# Altium schematic sheet Sheet1.SchDoc
size A3
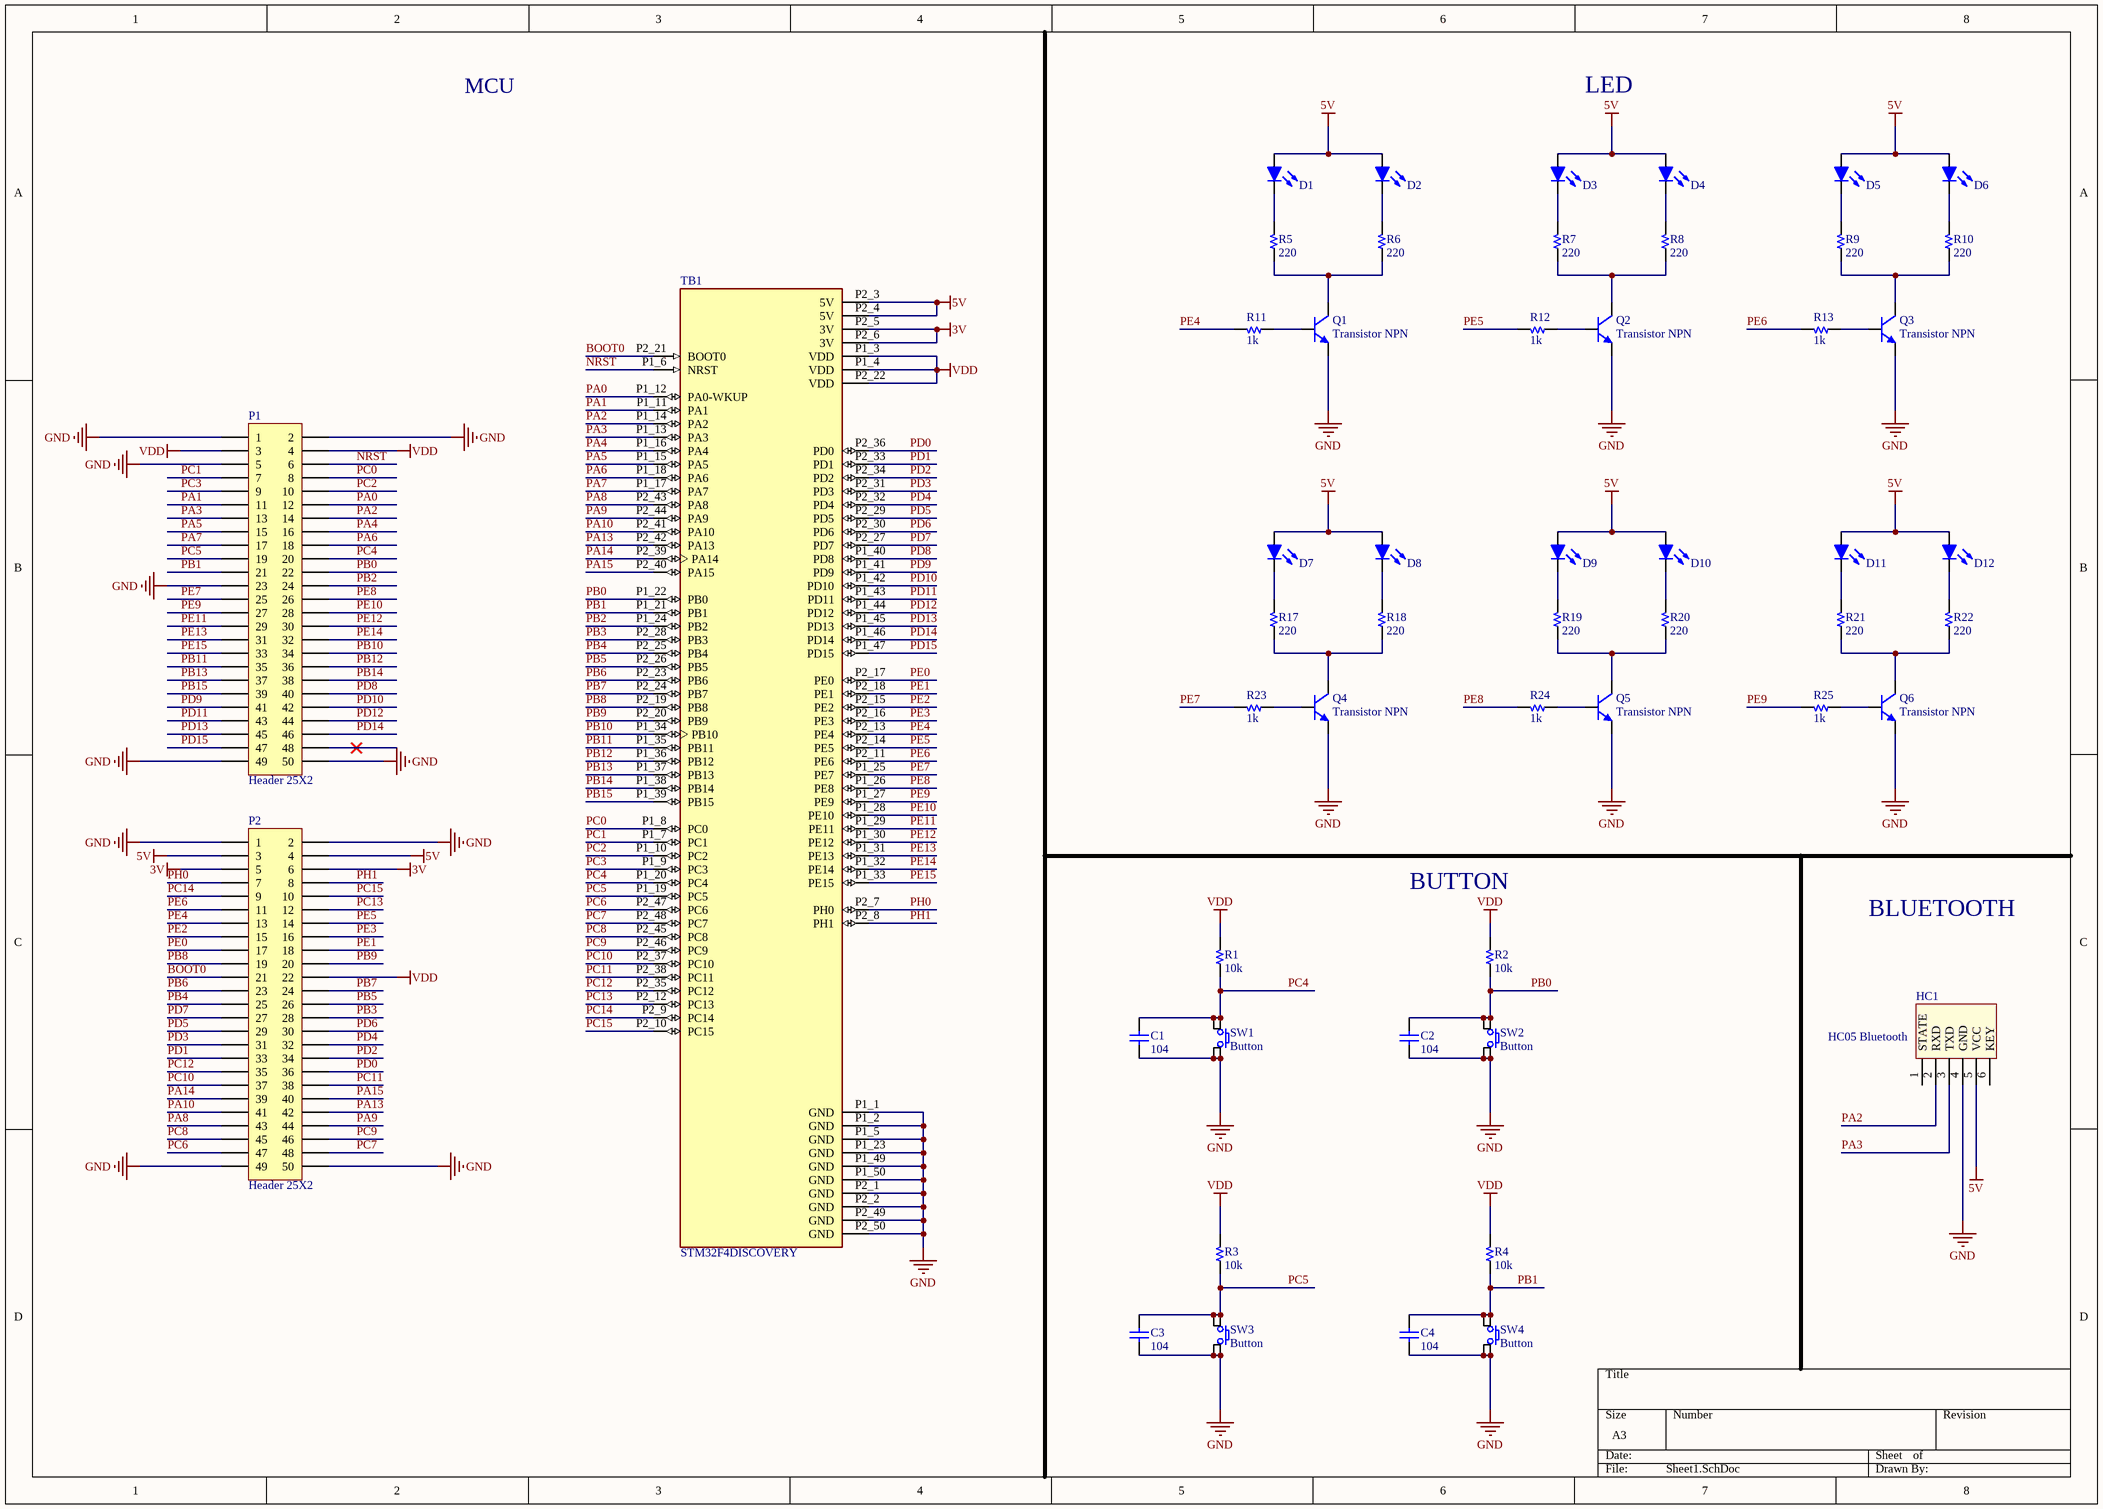
[diagram p0: Sheet1.SchDoc]

## Parts
C1  104  [CAP Ceramic/W300]
C2  104  [CAP Ceramic/W300]
C3  104  [CAP Ceramic/W300]
C4  104  [CAP Ceramic/W300]
D1  Led  [LED 3MM - green]  (value not drawn)
D2  Led  [LED 3MM - green]  (value not drawn)
D3  Led  [LED 3MM - yellow]  (value not drawn)
D4  Led  [LED 3MM - yellow]  (value not drawn)
D5  Led  [LED 3MM - red]  (value not drawn)
D6  Led  [LED 3MM - red]  (value not drawn)
D7  Led  [LED 3MM - green]  (value not drawn)
D8  Led  [LED 3MM - green]  (value not drawn)
D9  Led  [LED 3MM - yellow]  (value not drawn)
D10  Led  [LED 3MM - yellow]  (value not drawn)
D11  Led  [LED 3MM - red]  (value not drawn)
D12  Led  [LED 3MM - red]  (value not drawn)
HC1  HC05 Bluetooth  [HC05 Bluethooth Dung]
P1  Header 25X2  [HDR2X25]
P2  Header 25X2  [HDR2X25]
Q1  Transistor NPN  [TO-92/W100]
Q2  Transistor NPN  [TO-92/W100]
Q3  Transistor NPN  [TO-92/W100]
Q4  Transistor NPN  [TO-92/W100]
Q5  Transistor NPN  [TO-92/W100]
Q6  Transistor NPN  [TO-92/W100]
R1  10k  [R 1/4W/300]
R2  10k  [R 1/4W/300]
R3  10k  [R 1/4W/300]
R4  10k  [R 1/4W/300]
R5  220  [R 1/4W/300]
R6  220  [R 1/4W/300]
R7  220  [R 1/4W/300]
R8  220  [R 1/4W/300]
R9  220  [R 1/4W/300]
R10  220  [R 1/4W/300]
R11  1k  [R 1/4W/300]
R12  1k  [R 1/4W/300]
R13  1k  [R 1/4W/300]
R17  220  [R 1/4W/300]
R18  220  [R 1/4W/300]
R19  220  [R 1/4W/300]
R20  220  [R 1/4W/300]
R21  220  [R 1/4W/300]
R22  220  [R 1/4W/300]
R23  1k  [R 1/4W/300]
R24  1k  [R 1/4W/300]
R25  1k  [R 1/4W/300]
SW1  Button  [SW/4/12mm]
SW2  Button  [SW/4/12mm]
SW3  Button  [SW/4/12mm]
SW4  Button  [SW/4/12mm]
TB1  STM32F4DISCOVERY  [MODULE_STM32F4DISCOVERY]

## Nets
3V: P2.5 P2.6 TB1.P2_5(3V) TB1.P2_6(3V)
5V: D1.1(A) D2.1(A) D3.1(A) D4.1(A) D5.1(A) D6.1(A) D7.1(A) D8.1(A) D9.1(A) D10.1(A) D11.1(A) D12.1(A) HC1.5(VCC) P2.3 P2.4 TB1.P2_3(5V) TB1.P2_4(5V)
GND: C1.2 C2.2 C3.2 C4.2 HC1.4(GND) P1.1 P1.2 P1.5 P1.23 P1.49 P1.50 P2.1 P2.2 P2.49 P2.50 Q1.2(E) Q2.2(E) Q3.2(E) Q4.2(E) Q5.2(E) Q6.2(E) SW1.3 SW1.4 SW2.3 SW2.4 SW3.3 SW3.4 SW4.3 SW4.4 TB1.P1_1(GND) TB1.P1_2(GND) TB1.P1_5(GND) TB1.P1_23(GND) TB1.P1_49(GND) TB1.P1_50(GND) TB1.P2_1(GND) TB1.P2_2(GND) TB1.P2_49(GND) TB1.P2_50(GND)
VDD: P1.3 P1.4 P2.22 R1.2 R2.2 R3.2 R4.2 TB1.P1_3(VDD) TB1.P1_4(VDD) TB1.P2_22(VDD)
BOOT0: P2.21 TB1.P2_21(BOOT0)
NRST: P1.6 TB1.P1_6(NRST)
PA0: P1.12 TB1.P1_12(PA0-WKUP)
PA1: P1.11 TB1.P1_11(PA1)
PA2: HC1.2(RXD) P1.14 TB1.P1_14(PA2)
PA3: HC1.3(TXD) P1.13 TB1.P1_13(PA3)
PA4: P1.16 TB1.P1_16(PA4)
PA5: P1.15 TB1.P1_15(PA5)
PA6: P1.18 TB1.P1_18(PA6)
PA7: P1.17 TB1.P1_17(PA7)
PA8: P2.43 TB1.P2_43(PA8)
PA9: P2.44 TB1.P2_44(PA9)
PA10: P2.41 TB1.P2_41(PA10)
PA13: P2.42 TB1.P2_42(PA13)
PA14: P2.39 TB1.P2_39(PA14)
PA15: P2.40 TB1.P2_40(PA15)
PB0: C2.1 P1.22 R2.1 SW2.1 SW2.2 TB1.P1_22(PB0)
PB1: C4.1 P1.21 R4.1 SW4.1 SW4.2 TB1.P1_21(PB1)
PB2: P1.24 TB1.P1_24(PB2)
PB3: P2.28 TB1.P2_28(PB3)
PB4: P2.25 TB1.P2_25(PB4)
PB5: P2.26 TB1.P2_26(PB5)
PB6: P2.23 TB1.P2_23(PB6)
PB7: P2.24 TB1.P2_24(PB7)
PB8: P2.19 TB1.P2_19(PB8)
PB9: P2.20 TB1.P2_20(PB9)
PB10: P1.34 TB1.P1_34(PB10)
PB11: P1.35 TB1.P1_35(PB11)
PB12: P1.36 TB1.P1_36(PB12)
PB13: P1.37 TB1.P1_37(PB13)
PB14: P1.38 TB1.P1_38(PB14)
PB15: P1.39 TB1.P1_39(PB15)
PC0: P1.8 TB1.P1_8(PC0)
PC1: P1.7 TB1.P1_7(PC1)
PC2: P1.10 TB1.P1_10(PC2)
PC3: P1.9 TB1.P1_9(PC3)
PC4: C1.1 P1.20 R1.1 SW1.1 SW1.2 TB1.P1_20(PC4)
PC5: C3.1 P1.19 R3.1 SW3.1 SW3.2 TB1.P1_19(PC5)
PC6: P2.47 TB1.P2_47(PC6)
PC7: P2.48 TB1.P2_48(PC7)
PC8: P2.45 TB1.P2_45(PC8)
PC9: P2.46 TB1.P2_46(PC9)
PC10: P2.37 TB1.P2_37(PC10)
PC11: P2.38 TB1.P2_38(PC11)
PC12: P2.35 TB1.P2_35(PC12)
PC13: P2.12 TB1.P2_12(PC13)
PC14: P2.9 TB1.P2_9(PC14)
PC15: P2.10 TB1.P2_10(PC15)
PD0: P2.36 TB1.P2_36(PD0)
PD1: P2.33 TB1.P2_33(PD1)
PD2: P2.34 TB1.P2_34(PD2)
PD3: P2.31 TB1.P2_31(PD3)
PD4: P2.32 TB1.P2_32(PD4)
PD5: P2.29 TB1.P2_29(PD5)
PD6: P2.30 TB1.P2_30(PD6)
PD7: P2.27 TB1.P2_27(PD7)
PD8: P1.40 TB1.P1_40(PD8)
PD9: P1.41 TB1.P1_41(PD9)
PD10: P1.42 TB1.P1_42(PD10)
PD11: P1.43 TB1.P1_43(PD11)
PD12: P1.44 TB1.P1_44(PD12)
PD13: P1.45 TB1.P1_45(PD13)
PD14: P1.46 TB1.P1_46(PD14)
PD15: P1.47 TB1.P1_47(PD15)
PE0: P2.17 TB1.P2_17(PE0)
PE1: P2.18 TB1.P2_18(PE1)
PE2: P2.15 TB1.P2_15(PE2)
PE3: P2.16 TB1.P2_16(PE3)
PE4: P2.13 R11.2 TB1.P2_13(PE4)
PE5: P2.14 R12.2 TB1.P2_14(PE5)
PE6: P2.11 R13.2 TB1.P2_11(PE6)
PE7: P1.25 R23.2 TB1.P1_25(PE7)
PE8: P1.26 R24.2 TB1.P1_26(PE8)
PE9: P1.27 R25.2 TB1.P1_27(PE9)
PE10: P1.28 TB1.P1_28(PE10)
PE11: P1.29 TB1.P1_29(PE11)
PE12: P1.30 TB1.P1_30(PE12)
PE13: P1.31 TB1.P1_31(PE13)
PE14: P1.32 TB1.P1_32(PE14)
PE15: P1.33 TB1.P1_33(PE15)
PH0: P2.7 TB1.P2_7(PH0)
PH1: P2.8 TB1.P2_8(PH1)
NetD1_2: D1.2(K) R5.2
NetD2_2: D2.2(K) R6.2
NetD3_2: D3.2(K) R7.2
NetD4_2: D4.2(K) R8.2
NetD5_2: D5.2(K) R9.2
NetD6_2: D6.2(K) R10.2
NetD7_2: D7.2(K) R17.2
NetD8_2: D8.2(K) R18.2
NetD9_2: D9.2(K) R19.2
NetD10_2: D10.2(K) R20.2
NetD11_2: D11.2(K) R21.2
NetD12_2: D12.2(K) R22.2
NetQ1_1: Q1.1(B) R11.1
NetQ1_3: Q1.3(C) R5.1 R6.1
NetQ2_1: Q2.1(B) R12.1
NetQ2_3: Q2.3(C) R7.1 R8.1
NetQ3_1: Q3.1(B) R13.1
NetQ3_3: Q3.3(C) R9.1 R10.1
NetQ4_1: Q4.1(B) R23.1
NetQ4_3: Q4.3(C) R17.1 R18.1
NetQ5_1: Q5.1(B) R24.1
NetQ5_3: Q5.3(C) R19.1 R20.1
NetQ6_1: Q6.1(B) R25.1
NetQ6_3: Q6.3(C) R21.1 R22.1

Not connected (* = marked no-connect by the designer): HC1 1(STATE) 6(KEY); P1 48*

## Notes on the sheet
- MCU
- LED
- BUTTON
- BLUETOOTH

## Library data of the parts
C1-C4 = Capacitor NP: Capacitor non-pol
D1-D12 = Led: Typical LED
HC1 = HC05 Bluetooth: Bluetooth HC05; Value: Connector 6
P1 P2 = Header 25X2: Header, 25-Pin, Dual row; LatestRevisionDate: 17-Jul-2002; LatestRevisionNote: Re-released for DXP Platform.; Publisher: Altium Limited
Q1-Q6 = Transistor NPN: NPN Bipolar Transistor; pin to pad: 1>3 2>1 3>2
R1-R13 R17-R25 = Resistor
SW1-SW4 = SW SPST 4-pin: Tact switch 4-pin
TB1 = STM32F4DISCOVERY: Development kit: ARM ST; pin strips, pin header; No.of; Availability: Unavailable; MP: STM32F4DISCOVERY; Value: *; Price: None; Package: None